# Altium schematic sheet ALertPlus_Smart_watch.SchDoc
size A; SheetNumber: 1; SheetTotal: 2
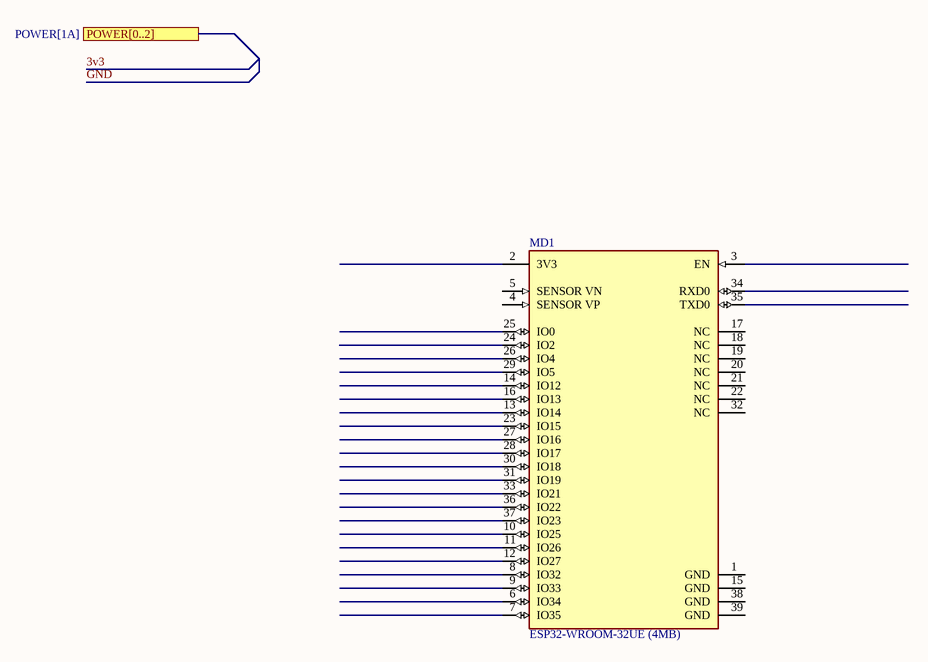
[diagram p0: ALertPlus_Smart_watch.SchDoc]

## Parts
MD1  ESP32-WROOM-32UE (4MB)  [FP-ESP32-WROOM-32UE_4MB-MFG]

## Ports
POWER[0..2] (see POWER[1A])

## Nets

Not connected (* = marked no-connect by the designer): MD1 1(GND) 2(3V3) 3(EN) 4(SENSOR_VP) 5(SENSOR_VN) 6(IO34) 7(IO35) 8(IO32) 9(IO33) 10(IO25) 11(IO26) 12(IO27) 13(IO14) 14(IO12) 15(GND) 16(IO13) 17(NC) 18(NC) 19(NC) 20(NC) 21(NC) 22(NC) 23(IO15) 24(IO2) 25(IO0) 26(IO4) 27(IO16) 28(IO17) 29(IO5) 30(IO18) 31(IO19) 32(NC) 33(IO21) 34(RXD0) 35(TXD0) 36(IO22) 37(IO23) 38(GND) 39(GND)

## Library data of the parts
MD1 = CMP-194065-000015-1: RX TXRX MODULE WIFI U.FL SMD